# Altium schematic sheet fiber.SCHDOC
size B
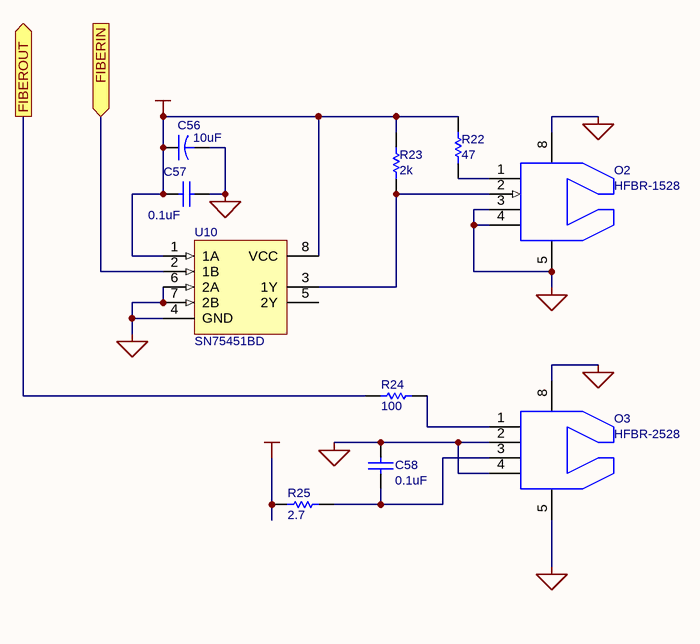
[diagram p0: fiber.SCHDOC]

## Parts
C56  value 10uF  [TC3528-1411]
C57  value 0.1uF  [CC1005-0402]  (hidden comment: Cap)
C58  value 0.1uF  [CC1005-0402]  (hidden comment: Cap)
O2  HFBR-1528  [HPVL]
O3  HFBR-2528  [HPVL]
R22  value 47  [CR1608-0603]  (hidden comment: Res1)
R23  value 2k  [CR1608-0603]  (hidden comment: Res1)
R24  value 100  [CR1608-0603]  (hidden comment: Res1)
R25  value 2.7  [CR1608-0603]  (hidden comment: Res1)
U10  SN75451BD  [SO-G8/E2.5]

## Ports
FIBERIN (in), FIBEROUT (out)

## Nets
+5VCC: C56.1 C57.1 R22.2 R23.2 R25.1 U10.1(1A) U10.8(VCC)
GND: C56.2 C57.2 C58.2 O2.3 O2.4 O2.5 O2.8 O3.2 O3.4 O3.5 O3.8 U10.4(GND) U10.6(2A) U10.7(2B)
FIBERIN: U10.2(1B) ; port FIBERIN
FIBEROUT: R24.1 ; port FIBEROUT
NetC58_1: C58.1 O3.3 R25.2
NetO2_1: O2.1 R22.1
NetO2_2: O2.2 R23.1 U10.3(1Y)
NetO3_1: O3.1 R24.2

Not connected (* = marked no-connect by the designer): U10 5(2Y)

## Notes on the sheet
- Title:
- Engineer:
- Date:
- Revision:
- Sheet
- of
- File:

## Library data of the parts
C56 = Cap2: Capacitor; Manufacturer: Generic Components; Class I: Passive; Published: 23-Sep-2002; Publisher: Altium Limited; Class II: Capacitor
C57 C58 = Cap: Capacitor; Manufacturer: Generic Components; Class I: Passive; Published: 8-Jun-2000; Revision: July-2002: Re-released for DXP Platform.; Publisher: Altium Limited; Class II: Capacitor
O2 = HFBR-1528: Low-cost fiber transmitter
O3 = HFBR-2528: Low-cost fiber receiver
R22-R25 = Res1: Resistor; Manufacturer: Generic Components; Class I: Passive; Published: 8-Jun-2000; Revision: July-2002: Re-released for DXP Platform.; Publisher: Altium Limited; Class II: Resistor
U10 = SN75451BD: Dual Peripheral Driver; Manufacturer: Texas Instruments; Package Information: Latest Revision: Jan-1998; Class I: Interface; Published: 15-May-2002; Datasheet: 1991 Interface Circuits Data Book (May-1990); Package Reference: D008; Publisher: Altium Limited; Class II: Peripheral Driver